# EAGLE design Battery Voltage Monitoring Schematic (EAGLE 8.2.2)
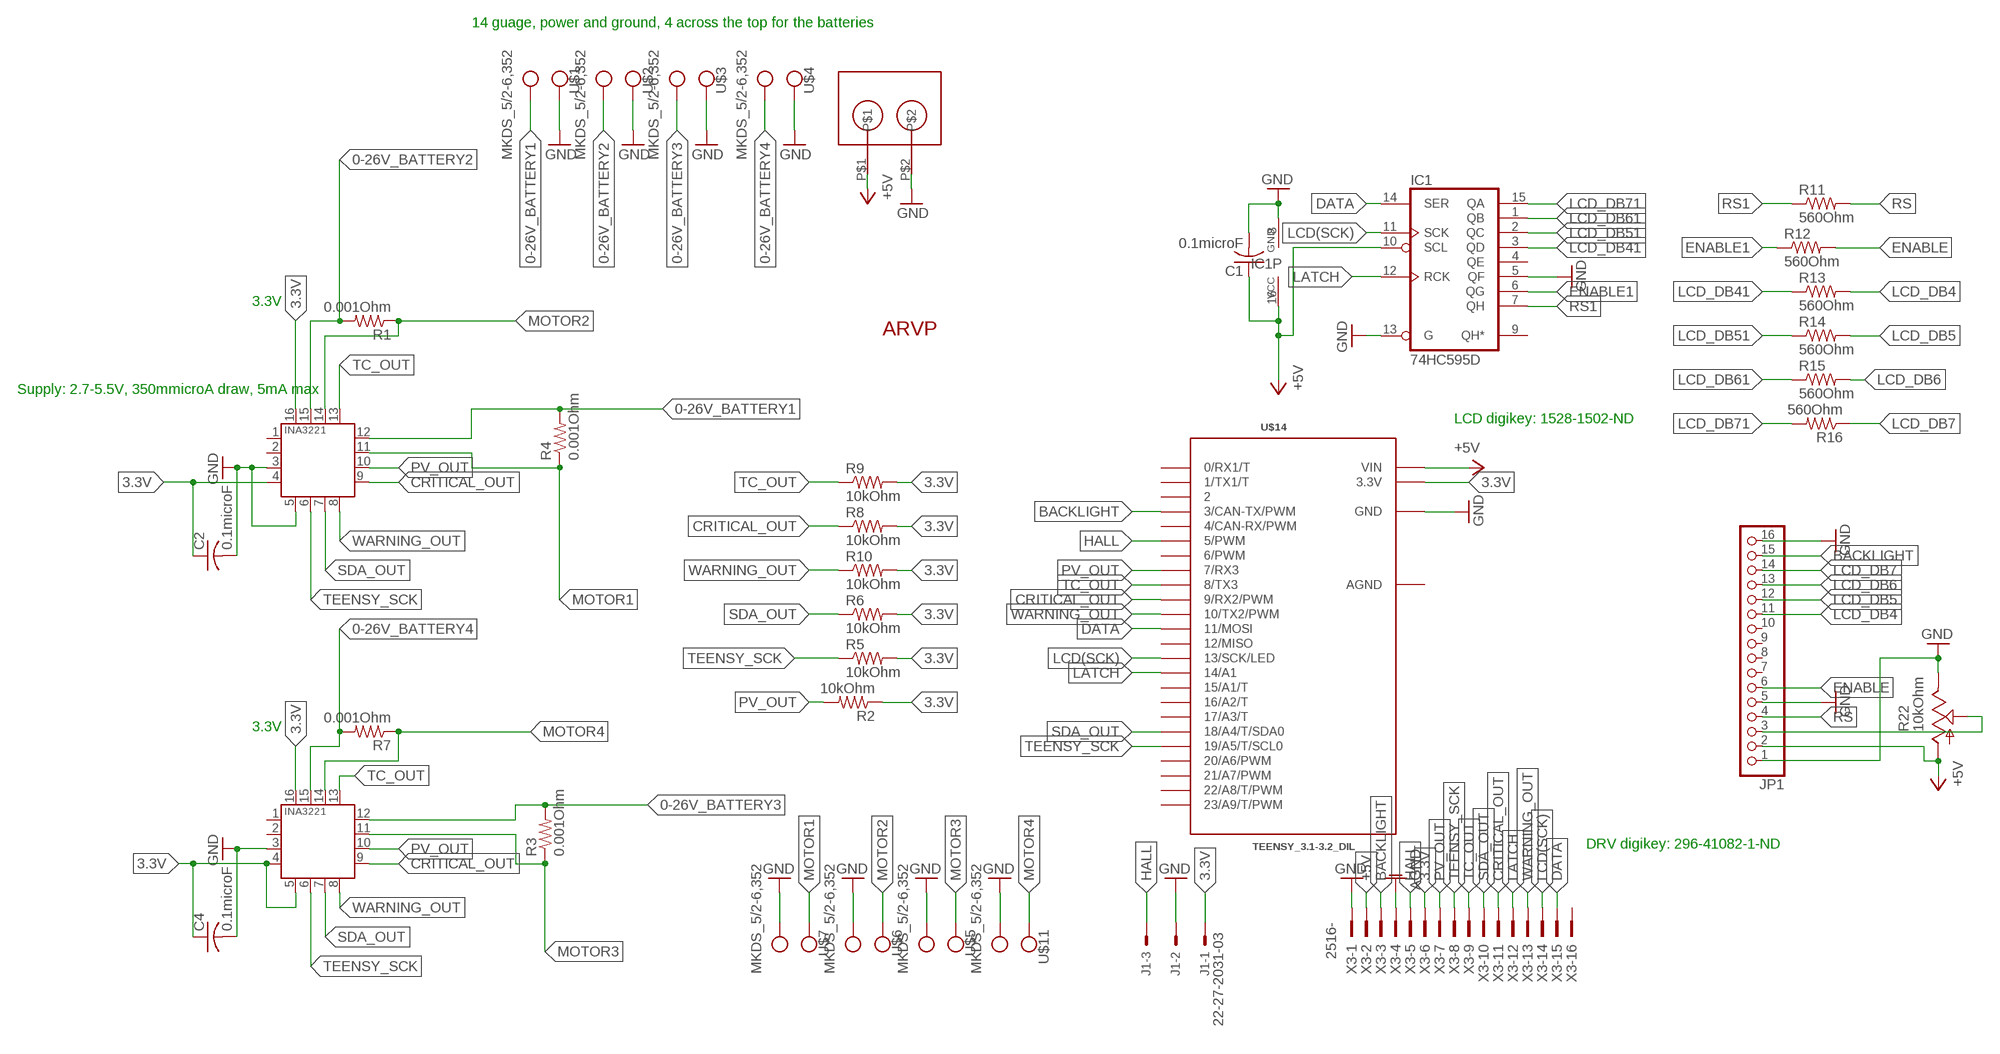
[diagram p0: schematic, sheet 1]

## Parts
C1  0.1microF  C-USC2012  [C2012]
C2  0.1microF  C-USC2012  [C2012]
C4  0.1microF  C-USC2012  [C2012]
IC1  74HC595D  [SO16]
J1  22-27-2031-03  [6410-03]
JP1  PINHD-1X16  [1X16]
R1  0.001Ohm  HCS3920FT1L00  [3920]
R2  10kOhm  R-US_M2012  [M2012]
R3  0.001Ohm  HCS3920FT1L00  [3920]
R4  0.001Ohm  HCS3920FT1L00  [3920]
R5  10kOhm  R-US_M2012  [M2012]
R6  10kOhm  R-US_M2012  [M2012]
R7  0.001Ohm  HCS3920FT1L00  [3920]
R8  10kOhm  R-US_M2012  [M2012]
R9  10kOhm  R-US_M2012  [M2012]
R10  10kOhm  R-US_M2012  [M2012]
R11  560Ohm  R-US_M2012  [M2012]
R12  560Ohm  R-US_M2012  [M2012]
R13  560Ohm  R-US_M2012  [M2012]
R14  560Ohm  R-US_M2012  [M2012]
R15  560Ohm  R-US_M2012  [M2012]
R16  560Ohm  R-US_M2012  [M2012]
R22  10kOhm  TRIM_US-SM-42/43W  [SM-42/43W]
U1  INA3221.  [HVQFN16_4X4]
U2  INA3221.  [HVQFN16_4X4]
U$1  MKDS_5/2-6,352  [MKDS_5/2-6,35]
U$2  MKDS_5/2-6,352  [MKDS_5/2-6,35]
U$3  MKDS_5/2-6,352  [MKDS_5/2-6,35]
U$4  MKDS_5/2-6,352  [MKDS_5/2-6,35]
U$5  MKDS_5/2-6,352  [MKDS_5/2-6,35]
U$6  MKDS_5/2-6,352  [MKDS_5/2-6,35]
U$7  MKDS_5/2-6,352  [MKDS_5/2-6,35]
U$9  ARVP_MOLEX_FEMALE  [ARVP_MOLEX_FEMALE]
U$10  ARVP_LOGO  [ARVP]
U$11  MKDS_5/2-6,352  [MKDS_5/2-6,35]
U$14  TEENSY_3.1-3.2_DIL  [TEENSY_3.0-3.2&LC_DIL]
X3  2516-  [PAK100/2500-16]

## Nets
0-26V_BATTERY1: R4.P$2 U1.12(IN+1) U$1.1(KL)
0-26V_BATTERY2: R1.P$2 U1.15(IN+2) U$2.1(KL)
0-26V_BATTERY3: R3.P$2 U2.12(IN+1) U$3.1(KL)
0-26V_BATTERY4: R7.P$2 U2.15(IN+2) U$4.1(KL)
3.3V: C2.1 C4.1 J1.1 R2.1 R5.2 R6.2 R8.2 R9.2 R10.2 U1.4(VS) U1.16(VPU) U2.4(VS) U2.5(A0) U2.16(VPU) U$14.3.3V X3.6
+5V: C1.1 IC1.10(SCL) IC1.16(VCC) JP1.2 R22.1(A) U$9.P$1 U$14.VIN X3.2
AGND: X3.4
BACKLIGHT: JP1.15 U$14.3(3/CAN-TX/PWM) X3.3
CRITICAL_OUT: R8.1 U1.9(CRITICAL) U2.9(CRITICAL) U$14.9(9/RX2/PWM) X3.11
DATA: IC1.14(SER) U$14.11(11/MOSI) X3.15
ENABLE: JP1.6 R12.2
ENABLE1: IC1.6(QG) R12.1
GND: C1.2 C2.2 C4.2 IC1.5(QF) IC1.8(GND) IC1.13(G) J1.2 JP1.1 JP1.5 JP1.16 R22.3(E) U1.3(GND) U1.5(A0) U2.3(GND) U$1.2(KL1) U$2.2(KL1) U$3.2(KL1) U$4.2(KL1) U$5.1(KL) U$6.1(KL) U$7.1(KL) U$9.P$2 U$11.1(KL) U$14.GND X3.1
HALL: J1.3 U$14.5(5/PWM) X3.5
LATCH: IC1.12(RCK) U$14.14/A0(14/A1) X3.12
LCD(SCK): IC1.11(SCK) U$14.13(13/SCK/LED) X3.14
LCD_DB4: JP1.11 R13.2
LCD_DB5: JP1.12 R14.2
LCD_DB6: JP1.13 R15.2
LCD_DB7: JP1.14 R16.1
LCD_DB41: IC1.3(QD) R13.1
LCD_DB51: IC1.2(QC) R14.1
LCD_DB61: IC1.1(QB) R15.1
LCD_DB71: IC1.15(QA) R16.2
MOTOR1: R4.P$1 U1.11(IN-1) U$7.2(KL1)
MOTOR2: R1.P$1 U1.14(IN-2) U$6.2(KL1)
MOTOR3: R3.P$1 U2.11(IN-1) U$5.2(KL1)
MOTOR4: R7.P$1 U2.14(IN-2) U$11.2(KL1)
N$18: JP1.3 R22.2(S)
PV_OUT: R2.2 U1.10(PV) U2.10(PV) U$14.7(7/RX3) X3.7
RS: JP1.4 R11.2
RS1: IC1.7(QH) R11.1
SDA_OUT: R6.1 U1.7(SDA) U2.7(SDA) U$14.18/A4(18/A4/T/SDA0) X3.10
TC_OUT: R9.1 U1.13(TC) U2.13(TC) U$14.8(8/TX3) X3.9
TEENSY_SCK: R5.1 U1.6(SCL) U2.6(SCL) U$14.19/A5(19/A5/T/SCL0) X3.8
WARNING_OUT: R10.1 U1.8(WARNING) U2.8(WARNING) U$14.10(10/TX2/PWM) X3.13
Unconnected: IC1.4(QE) IC1.9(QH*) JP1.7 JP1.8 JP1.9 JP1.10 U1.1(IN-3) U1.2(IN+3) U2.1(IN-3) U2.2(IN+3) U$14.0(0/RX1/T) U$14.1(1/TX1/T) U$14.2 U$14.4(4/CAN-RX/PWM) U$14.6(6/PWM) U$14.12(12/MISO) U$14.15/A1(15/A1/T) U$14.16/A2(16/A2/T) U$14.17/A3(17/A3/T) U$14.20/A6(20/A6/PWM) U$14.21/A7(21/A7/PWM) U$14.22/A8(22/A8/T/PWM) U$14.23/A9(23/A9/T/PWM) X3.16

## Notes on the sheet
- 14 guage, power and ground, 4 across the top for the batteries
- 3.3V
- Supply: 2.7-5.5V, 350mmicroA draw, 5mA max
- LCD digikey: 1528-1502-ND
- 3.3V
- DRV digikey: 296-41082-1-ND

## Power pins joined to a net without a drawn wire
AGND: U$14.AGND

## Library data of the parts
C1 C2 C4 = resistor:C-US: CAPACITOR, American symbol
IC1 = 74xx-eu:74*595: 8-bit SHIFT REGISTER, output latch
J1 = con-molex:22-?-03: CONNECTOR wire to board 2.54 mm (.1 inch) pitch header; OC_FARNELL: unknown; OC_NEWARK: unknown
JP1 = pinhead:PINHD-1X16: PIN HEADER
R1 R3 R4 R7 = Moira:HCS3920: 0.001 Ohm ±1% 5W Chip Resistor 4020 Automotive AEC-Q200, Current Sense, Moisture Resistant Metal Element Stackpole Electronics Inc. Digikey: HCS3920FT1L00CT-ND
R2 R5 R6 R8-R16 = rcl:R-US_: RESISTOR, American symbol
R22 = pot:TRIM_US-: POTENTIOMETER
U1 U2 = INA3221:INA3221: The INA3221 is a three-channel, high-side current and bus voltage monitor with an I 2C- and SMBUScompatible interface. The INA3221 monitors both shunt voltage drops and bus supply voltages, in addition to having programmable conversion times and averaging modes for these signals. The INA3221 offers both critical and warning alerts to detect multiple programmable out-of-range conditions for each channel.
U$1-U$7 U$11 = Moira:MKDS_5/2-6,35: CONN TERM BLOCK 2POS 6.35MM PCB, 2 Position Wire to Board Terminal Block Horizontal with Board 0.250" (6.35mm) Through Hole, Phoenix Contact (1714955), Digikey:277-1269-ND, MKDS 5/2-6,35 package adpated from Eagle library package MKDS 5/3-6,35
U$9 = ARVP_MOLEX_FEMALE:ARVP_MOLEX_FEMALE
U$10 = ARVP:ARVP_LOGO
U$14 = Teensy_3_and_LC_Series_Boards_v1.4:TEENSY_3.1-3.2_DIL: Teensy 3.1 or 3.2 in a DIL Layout.
X3 = con-3m:2516-: 3M (TM) Pak 100 4-Wall Header Source: 3M; OC_FARNELL: unknown; OC_NEWARK: unknown

## Board
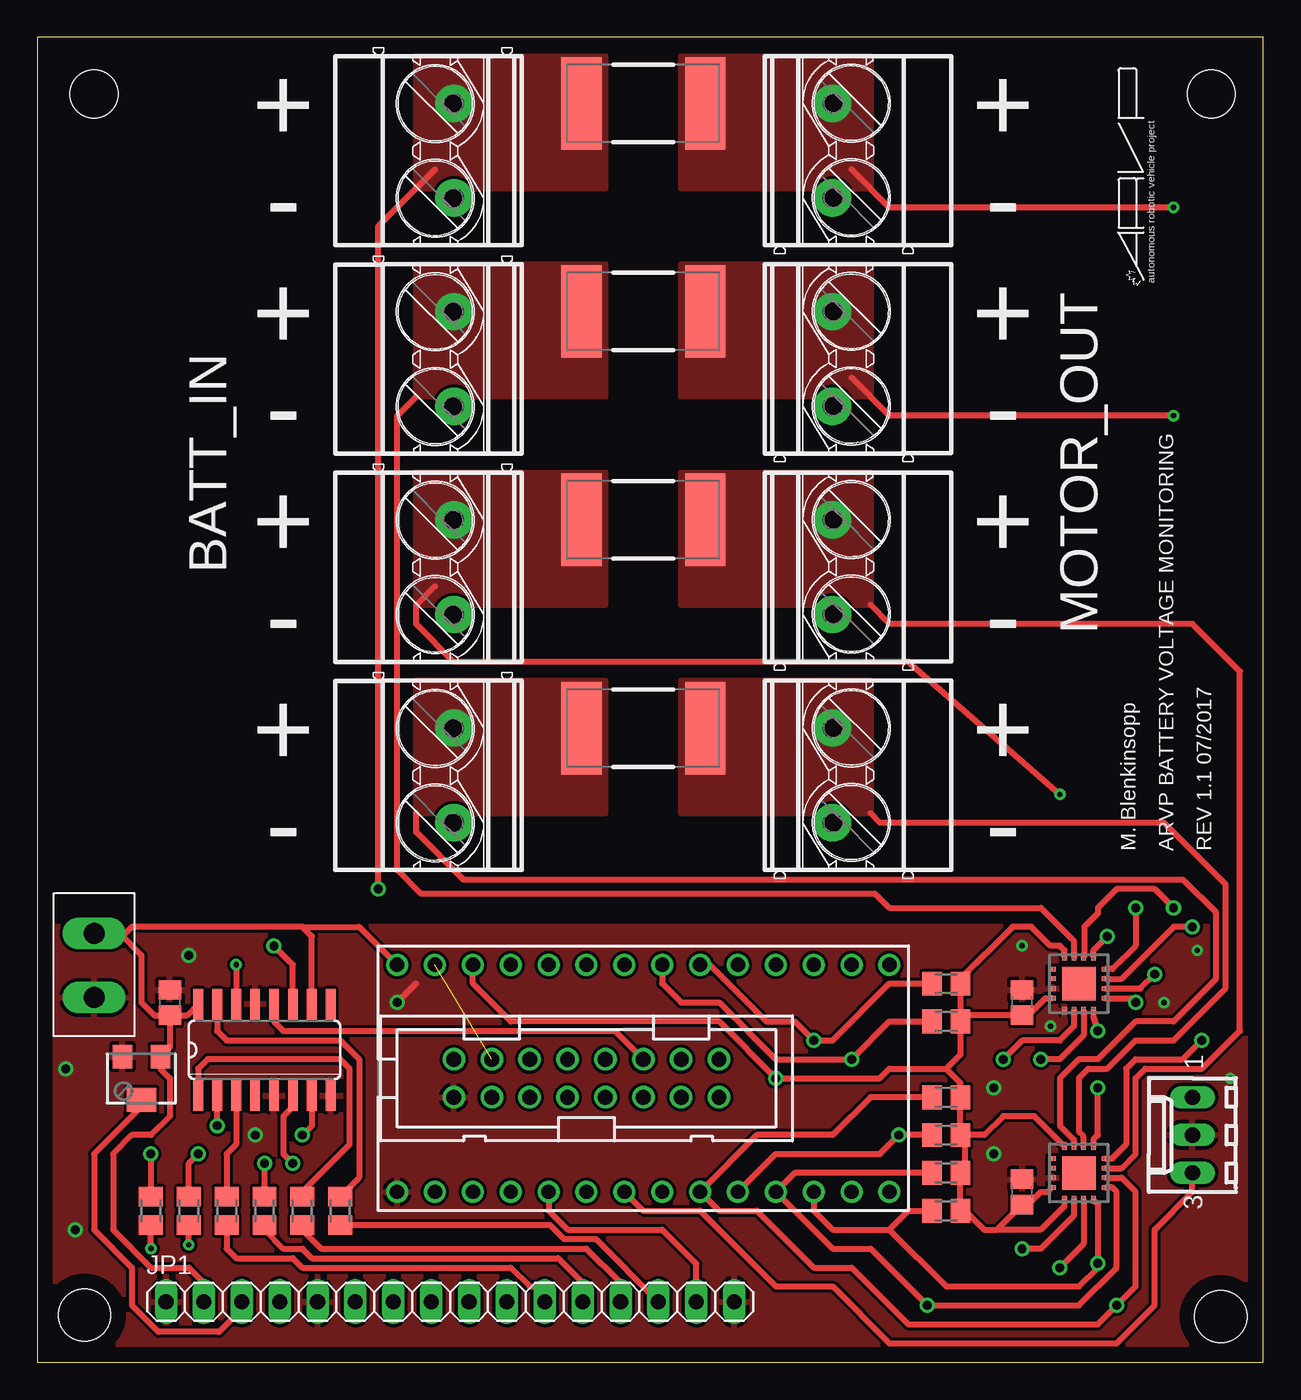
[diagram p1: board, top side]
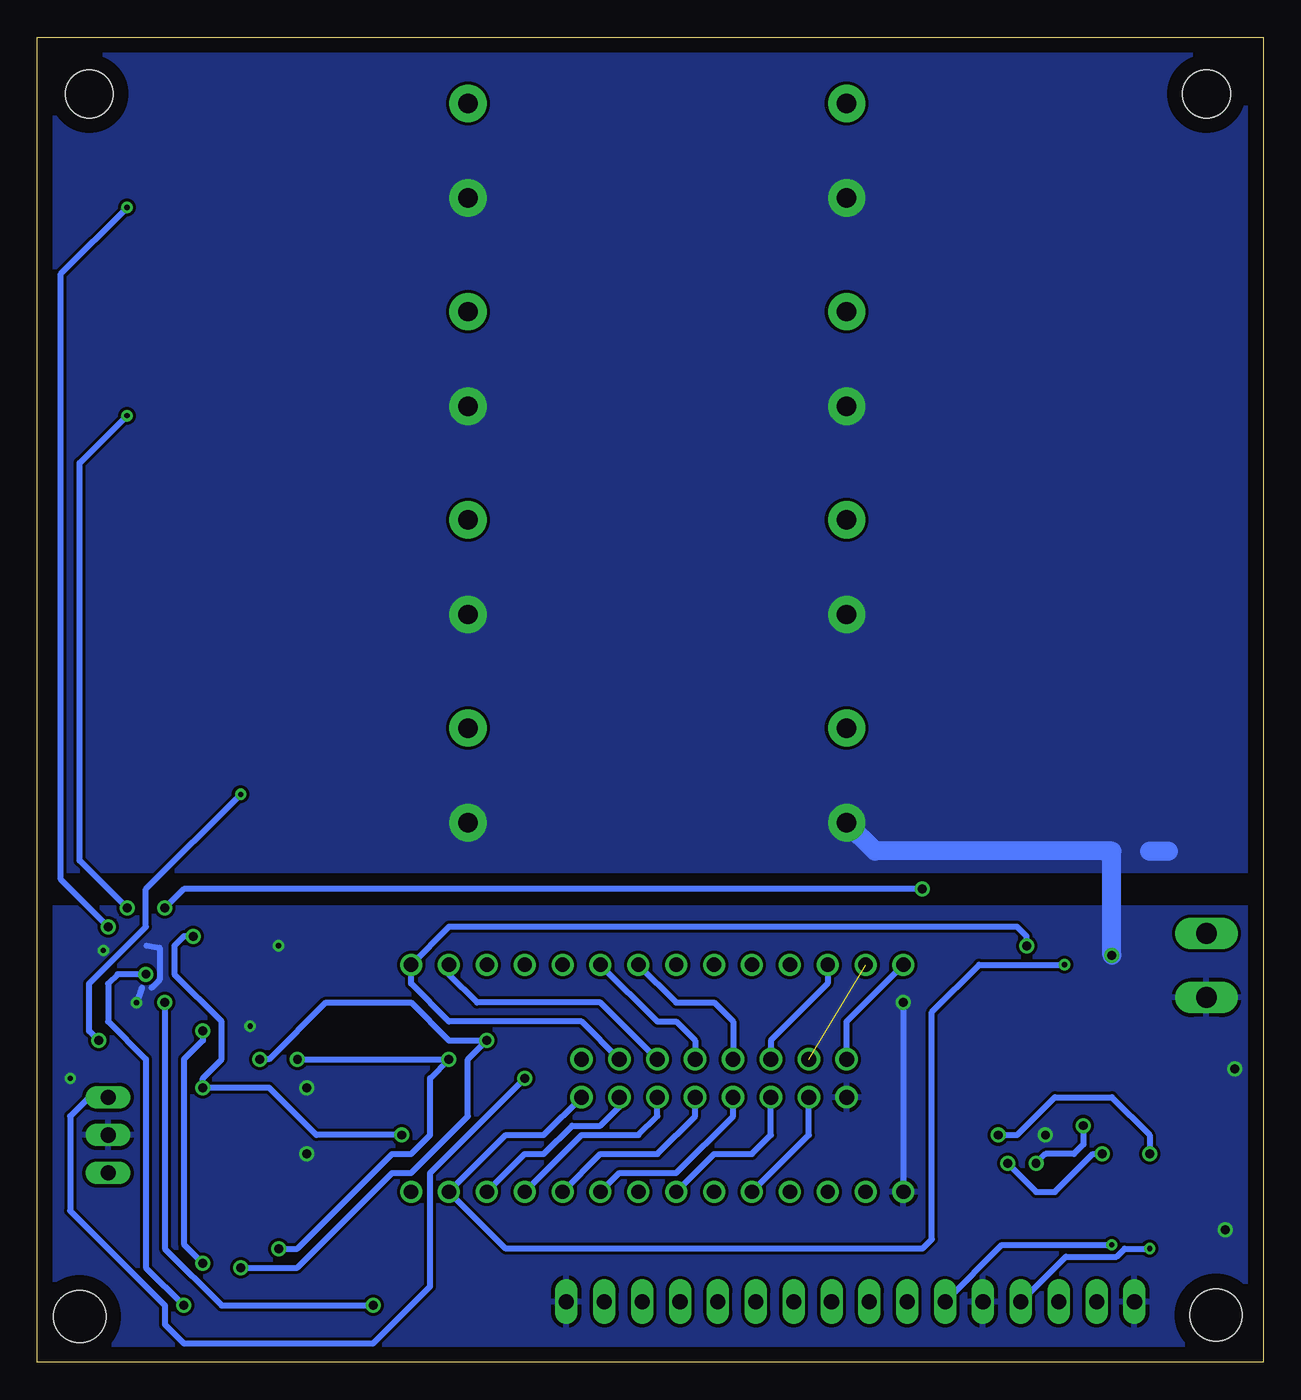
[diagram p2: board, bottom side, seen from below]

Size 82.22 x 88.89 mm. Coordinates in mm from the lower left corner, seen from the top.
Outline: 0,0 82.22,0 82.22,88.89 0,88.89 0,0
Copper layers (1*16): Top 0.035mm / dielectric 1.5mm / Bottom 0.035mm
Design rules "default": minimum track width 10mil, minimum drill 24mil, track to track 8mil, track to pad 8mil, pad to pad 8mil, via to via 8mil, smd to smd 8mil, copper to edge 40mil, drill to drill 8mil, minimum pad ring 10mil, minimum via ring 8mil, stop-mask expansion 4mil, vias tented up to drill 0mil, thermal gap 10mil
Holes 3.51 mm at 3.17,3.17 79.38,3.07
Holes 3.2 mm at 78.74,85.09 3.81,85.09

### Footprints (pad centres in the part's own frame; a part is rotated, then mirrored left to right if it is on the bottom)
C2012 = smd 1.3 x 1.5: 1 -0.85,0; 2 0.85,0
SO16 = smd 0.66 x 2.032: 1 -4.445,-3.073; 2 -3.175,-3.073; 3 -1.905,-3.073; 4 -0.635,-3.073; 5 0.635,-3.073; 6 1.905,-3.073; 7 3.175,-3.073; 8 4.445,-3.073; 9 4.445,3.073; 10 3.175,3.073; 11 1.905,3.073; 12 0.635,3.073; 13 -0.635,3.073; 14 -1.905,3.073; 15 -3.175,3.073; 16 -4.445,3.073
6410-03 = drill 1.016 long: 1 2.54,0; 2 0,0; 3 -2.54,0
1X16 = drill 1.016 long: 1 -19.05,0; 2 -16.51,0; 3 -13.97,0; 4 -11.43,0; 5 -8.89,0; 6 -6.35,0; 7 -3.81,0; 8 -1.27,0; 9 1.27,0; 10 3.81,0; 11 6.35,0; 12 8.89,0; 13 11.43,0; 14 13.97,0; 15 16.51,0; 16 19.05,0
3920 = smd 2.7 x 6.2: P$1 -4.15,0; P$2 4.15,0
M2012 = smd 1.3 x 1.6: 1 -0.95,0; 2 0.95,0
SM-42/43W = smd 1.3 x 1.6: 1 -1.27,-1.45; 3 1.27,-1.45 | smd 2 x 1.6: 2 0,1.45
HVQFN16_4X4 = smd 0.5 x 0.3: 1 -1.8,0.975; 2 -1.8,0.325; 3 -1.8,-0.325; 4 -1.8,-0.975; 9 1.8,-0.975; 10 1.8,-0.325; 11 1.8,0.325; 12 1.8,0.975 | smd 0.3 x 0.5: 5 -0.975,-1.8; 6 -0.325,-1.8; 7 0.325,-1.8; 8 0.975,-1.8; 13 0.975,1.8; 14 0.325,1.8; 15 -0.325,1.8; 16 -0.975,1.8 | smd 2.25 x 2.25: TH 0,0
MKDS_5/2-6,35 = drill 1.3 pad 2.5: 1 -3.175,0; 2 3.175,0
ARVP_MOLEX_FEMALE = drill 1.4 long: P$1 -2.1,0; P$2 2.2,0
TEENSY_3.0-3.2&LC_DIL = drill 0.965: 0 -7.62,13.97; 1 -7.62,11.43; 2 -7.62,8.89; 3 -7.62,6.35; 3.3V 7.62,11.43; 4 -7.62,3.81; 5 -7.62,1.27; 6 -7.62,-1.27; 7 -7.62,-3.81; 8 -7.62,-6.35; 9 -7.62,-8.89; 10 -7.62,-11.43; 11 -7.62,-13.97; 12 -7.62,-16.51; 13 7.62,-16.51; 14/A0 7.62,-13.97; 15/A1 7.62,-11.43; 16/A2 7.62,-8.89; 17/A3 7.62,-6.35; 18/A4 7.62,-3.81; 19/A5 7.62,-1.27; 20/A6 7.62,1.27; 21/A7 7.62,3.81; 22/A8 7.62,6.35; 23/A9 7.62,8.89; AGND 7.62,13.97; GND -7.62,16.51; VIN 7.62,16.51
PAK100/2500-16 = drill 1 pad 1.422: 1 -8.89,-1.27; 2 -8.89,1.27; 3 -6.35,-1.27; 4 -6.35,1.27; 5 -3.81,-1.27; 6 -3.81,1.27; 7 -1.27,-1.27; 8 -1.27,1.27; 9 1.27,-1.27; 10 1.27,1.27; 11 3.81,-1.27; 12 3.81,1.27; 13 6.35,-1.27; 14 6.35,1.27; 15 8.89,-1.27; 16 8.89,1.27

### Placement (x,y rotation side)
C1  8.89,24.13 90 top
C2  66.04,24.13 90 top
C4  66.04,11.43 90 top
IC1  15.24,20.95 0 top
J1  77.47,15.24 90 top
JP1  27.69,4.06 0 top
R1  40.64,70.48 180 top
R2  60.96,17.78 180 top
R3  40.64,56.52 180 top
R4  40.64,84.45 180 top
R5  60.96,22.86 0 top
R6  60.96,25.4 0 top
R7  40.64,42.55 180 top
R8  60.96,12.7 0 top
R9  60.96,15.24 0 top
R10  60.96,10.16 0 top
R11  7.62,10.16 270 top
R12  10.16,10.16 270 top
R13  12.7,10.16 270 top
R14  15.24,10.16 270 top
R15  17.78,10.16 270 top
R16  20.32,10.16 90 top
R22  6.98,19.05 180 top
U1  69.85,25.4 0 top
U2  69.85,12.7 0 top
U$1  27.94,81.28 270 top
U$2  27.94,67.31 270 top
U$3  27.94,53.34 270 top
U$4  27.94,39.37 270 top
U$5  53.34,53.34 90 top
U$6  53.34,67.31 90 top
U$7  53.34,81.28 90 top
U$9  3.81,26.67 270 top
U$10  74.93,72.39 90 top
U$11  53.34,39.37 90 top
U$14  40.64,19.05 90 top
X3  36.83,19.05 0 top

### Tracks (layer width: path | path; a pad name or v marks a point on that pad's centre or on a via)
0-26V_BATTERY1  (via drill 0.6)
  Top 0.406: v73.66,30.48 73.66,27.94 72.09,26.38 U1.12 | v22.86,31.75 22.86,76.2 26.67,80.01
  Bottom 0.406: v22.86,31.75 72.39,31.75 v73.66,30.48
  pour Top (no thermals): 38.1,87.63 38.1,78.74 25.4,78.74 25.4,87.63
0-26V_BATTERY2
  Top 0.406: U1.15 69.53,28.26 67.31,30.48 57.15,30.48 56.2,31.43 25.72,31.43 24.13,33.02 24.13,63.5 25.4,64.77 | 27.3,70.48 U$2.1
  pour Top (no thermals): 38.1,73.66 38.1,64.77 25.4,64.77 25.4,73.66
0-26V_BATTERY3  (via drill 0.35, 0.6)
  Top 0.406: U2.12 72.09,13.68 73.03,14.61 73.03,19.68 73.66,20.32 76.84,20.32 v78.11,21.59 | v68.58,38.1 58.42,46.99 27.94,46.99 25.4,49.53 25.4,50.8 26.67,52.07
  Bottom 0.406: v78.11,21.59 78.74,22.22 78.74,25.4 74.93,29.21 74.93,31.75 v68.58,38.1
  pour Top (no thermals): 38.1,59.69 38.1,50.8 25.4,50.8 25.4,59.69
0-26V_BATTERY4
  Top 0.406: U2.15 69.53,14.93 68.58,15.88 68.58,19.05 69.85,20.32 71.12,20.32 73.66,22.86 76.2,22.86 79.06,25.72 79.06,30.16 76.84,32.38 28.57,32.38 25.4,35.56 25.4,36.83
  pour Top (no thermals): 38.1,45.72 38.1,36.83 25.4,36.83 25.4,45.72
3.3V  (via drill 0.6)
  Top 0.406: U2.4 67.75,11.43 67.31,11.43 66.46,10.58 C4.1 64.35,8.89 | U1.4 67.61,24.42 66.46,23.28 C2.1 62.33,23.28 R5.2 | R9.2 62.23,14.92 62.23,12.7 R8.2 R10.2 62.23,10.16 63.5,8.89 64.35,8.89 | R9.2 R2.1 61.91,18.73 60.96,19.68 | U2.5 68.88,10.46 67.31,8.89 64.35,8.89 | U$14.3.3V 29.21,25.4 31.75,22.86 45.72,22.86 v49.53,19.05 56.52,19.05 57.15,19.68 60.96,19.68 | R5.2 R6.2 61.91,25.71 65.41,29.21 66.67,29.21 67.95,27.94 68.58,27.94 68.88,27.64 U1.16 | R5.2 61.91,20.63 60.96,19.68 | U2.16 66.86,16.51 64.77,16.51 63.5,15.24 R9.2
  Bottom 0.406: U$14.3.3V 29.21,25.4 33.02,21.59 X3.6 | J1.1 78.74,17.78 80.01,16.51 80.01,10.16 73.66,3.81 73.66,2.54 72.39,1.27 59.69,1.27 55.88,5.08 55.88,12.7 v49.53,19.05
+5V
  Top 0.406: 17.78,29.21 21.59,29.21 U$14.VIN | C1.1 8.89,21.13 R22.1 8.26,19.68 8.89,19.05 8.89,16.51 7.62,15.24 6.35,15.24 5.08,13.97 5.08,8.89 7.62,6.35 10.16,6.35 11.18,5.33 JP1.2 | C1.1 10.05,23.28 IC1.16 | IC1.10 18.41,28.57 17.78,29.21 | 5.52,28.77 6.98,27.3 6.98,24.13 7.84,23.28 C1.1 | 5.52,28.77 U$9.P$1 | 17.78,29.21 6.35,29.21 5.91,28.77 5.52,28.77
  Bottom 0.406: X3.2 27.94,22.86 U$14.VIN
AGND  (1 unrouted)
BACKLIGHT
  Top 0.406: U$14.3 34.29,10.16 35.56,8.89 41.91,8.89 44.2,6.6 JP1.15
  Bottom 0.406: U$14.3 30.48,15.24 X3.3
CRITICAL_OUT  (via drill 0.6)
  Top 0.406: U2.9 72.09,11.72 72.39,11.43 72.39,6.35 69.85,3.81 v59.69,3.81 55.88,7.62 53.34,7.62 U$14.9 50.8,12.7 R8.1 | U1.9 73.37,24.42 v73.66,24.13
  Bottom 0.406: U$14.9 45.72,15.24 41.91,15.24 40.64,16.51 X3.11 | v73.66,24.13 73.66,7.62 69.85,3.81 v59.69,3.81
DATA  (via drill 0.35)
  Top 0.406: v13.34,26.67 IC1.14
  Bottom 0.406: X3.15 48.26,15.24 50.8,15.24 U$14.11 50.8,7.62 22.86,7.62 22.22,8.26 22.22,23.49 19.05,26.67 v13.34,26.67
ENABLE  (via drill 0.35)
  Top 0.406: v10.16,7.87 R12.2
  Bottom 0.406: JP1.6 17.53,7.87 v10.16,7.87
ENABLE1  (via drill 0.6)
  Top 0.406: IC1.6 17.14,17.14 16.51,16.51 16.51,13.97 v17.14,13.34 | R12.1 10.16,13.34 v10.79,13.97
  Bottom 0.406: v17.14,13.34 15.24,11.43 13.97,11.43 11.43,13.97 v10.79,13.97
GND  (via drill 0.35, 0.6)
  Top 0.406: 66.14,12.38 C4.2 | 66.14,25.07 C2.2 | 25.4,25.4 v24.13,24.13
  Bottom 0.406: v24.13,24.13 U$14.GND | 74.55,25.12 74.02,25.66 74.02,27.81 74.88,27.96 | 75.2,25.12 v75.56,24.13
  Bottom 1.27: U$4.2 26.04,34.29 10.16,34.29 v10.16,27.3 | 7.62,34.29 6.35,34.29
  other vias: 1.91,19.68 2.54,8.89 14.61,15.24 64.14,18.41 64.14,13.97 80.01,19.05 77.79,27.62 67.95,22.54 66.04,27.94
  pour Top: 0,29.21 0,0 82.55,0 82.55,29.21
  pour Bottom: 0,0 82.55,0 82.55,30.48 0,30.48
  pour Bottom (no thermals): -1.27,90.17 82.55,90.17 82.55,33.02 -1.27,33.02
HALL
  Top 0.406: U$14.5 40.64,10.16 44.45,10.16 49.53,5.08 53.34,5.08 57.15,1.27 72.39,1.27 74.93,3.81 74.93,8.89 77.47,11.43 J1.3
  Bottom 0.406: U$14.5 36.83,13.97 34.29,13.97 33.02,15.24 X3.5
LATCH
  Top 0.406: IC1.12 15.88,22.86 16.51,22.22 38.73,22.22 X3.12
  Bottom 0.406: X3.12 44.45,24.13 52.72,24.13 54.61,26.02 U$14.14/A0
LCD(SCK)  (via drill 0.6)
  Top 0.406: IC1.11 17.14,26.67 v15.88,27.94
  Bottom 0.406: X3.14 45.72,22.86 54.61,22.86 57.15,25.4 U$14.13 54.61,29.21 16.51,29.21 15.88,28.57 v15.88,27.94
LCD_DB4
  Top 0.406: R13.2 12.7,7.62 13.34,6.98 17.14,6.98 17.78,6.35 31.75,6.35 33.02,5.08 33.66,5.08 34.04,4.7 JP1.11
LCD_DB5
  Top 0.406: R14.2 15.24,8.89 16.51,7.62 17.78,7.62 18.41,6.98 34.92,6.98 36.58,5.33 JP1.12
LCD_DB6
  Top 0.406: R15.2 17.78,8.89 19.05,7.62 36.83,7.62 39.06,5.39 | 39.06,5.39 39.12,5.33 | JP1.13 39.06,4.12 39.06,5.39
LCD_DB7
  Top 0.406: R16.1 34.38,9.21 35.31,8.28 37.44,8.28 JP1.14
LCD_DB41
  Top 0.406: IC1.3 13.34,14.61 12.7,13.97 R13.1
LCD_DB51  (via drill 0.6)
  Top 0.406: R14.1 v15.24,13.34 | v12.07,15.88 IC1.2
  Bottom 0.406: v12.07,15.88 12.07,14.61 12.7,13.97 14.61,13.97 v15.24,13.34
LCD_DB61
  Top 0.406: R15.1 17.78,11.43 20.95,14.61 20.95,19.68 20.32,20.32 11.43,20.32 10.79,19.68 IC1.1
LCD_DB71
  Top 0.406: IC1.15 12.07,22.22 12.7,21.59 20.32,21.59 21.59,20.32 21.59,12.38 R16.2
MOTOR1  (via drill 0.35, 0.6)
  Top 0.406: U1.11 72.72,25.72 76.2,29.21 v77.47,29.21 | v76.2,77.47 57.15,77.47 54.61,80.01
  Bottom 0.406: v77.47,29.21 80.64,32.38 80.64,73.03 v76.2,77.47
  pour Top (no thermals): 55.88,87.63 55.88,78.74 43.18,78.74 43.18,87.63
MOTOR2  (via drill 0.35, 0.6)
  Top 0.406: v76.2,30.48 74.93,31.75 72.39,31.75 71.12,30.48 71.12,30.11 70.22,29.21 70.22,27.24 U1.14 | v76.2,63.5 57.15,63.5 54.61,66.04
  Bottom 0.406: v76.2,30.48 79.38,33.66 79.38,60.33 v76.2,63.5
  pour Top (no thermals): 55.88,73.66 55.88,64.77 43.18,64.77 43.18,73.66
MOTOR3
  Top 0.406: U2.11 72.72,13.03 73.66,13.97 73.66,19.05 74.3,19.68 78.11,19.68 80.64,22.22 80.64,46.36 77.47,49.53 57.15,49.53 55.88,50.8
  pour Top (no thermals): 55.88,59.69 55.88,50.8 43.18,50.8 43.18,59.69
MOTOR4
  Top 0.406: 55.88,36.83 56.52,36.2 75.56,36.2 79.69,32.07 79.69,25.08 76.2,21.59 73.66,21.59 71.75,19.68 70.48,19.68 69.85,19.05 69.85,15.47 70.14,15.18 70.14,14.54 U2.14
  pour Top (no thermals): 55.88,45.72 55.88,36.83 43.18,36.83 43.18,45.72
N$18
  Top 0.406: R22.2 6.98,17.14 3.81,13.97 3.81,8.89 6.35,6.35 6.35,3.81 8.13,2.03 12.19,2.03 13.72,3.56 JP1.3
PV_OUT  (via drill 0.6)
  Top 0.406: U2.10 72.72,12.38 73.66,11.43 73.66,5.08 v72.39,3.81 71.12,2.54 58.42,2.54 54.61,6.35 52.07,6.35 48.26,10.16 45.72,10.16 U$14.7 48.26,15.24 53.34,15.24 55.88,17.78 R2.2 | U1.10 73.98,25.07 v74.93,26.04
  Bottom 0.406: X3.7 35.56,16.51 39.37,12.7 43.18,12.7 U$14.7 | v72.39,3.81 74.93,6.35 74.93,20.32 77.47,22.86 77.47,25.4 76.84,26.04 v74.93,26.04
RS  (via drill 0.35)
  Top 0.406: v7.62,7.62 R11.2
  Bottom 0.406: v7.62,7.62 9.3,7.62 9.84,7.09 13.23,7.09 JP1.4
RS1  (via drill 0.6)
  Top 0.406: IC1.7 18.41,15.88 v17.78,15.24 | v7.62,13.97 R11.1
  Bottom 0.406: v17.78,15.24 16.51,15.24 13.97,17.78 10.16,17.78 7.62,15.24 v7.62,13.97
SDA_OUT  (via drill 0.6)
  Top 0.406: U$14.18/A4 45.09,26.67 48.9,22.86 50.8,22.86 v52.07,21.59 53.34,21.59 57.15,25.4 R6.1 | U2.7 70.17,7.95 v68.58,6.35 | U1.7 70.17,21.91 68.58,20.32 v67.31,20.32
  Bottom 0.406: U$14.18/A4 40.64,22.86 39.37,22.86 38.1,21.59 X3.10 | v68.58,6.35 64.77,6.35 58.42,12.7 57.15,12.7 53.34,16.51 53.34,20.32 v52.07,21.59 54.61,21.59 57.15,24.13 62.87,24.13 66.67,20.32 v67.31,20.32
TC_OUT  (via drill 0.6)
  Top 0.406: R9.1 v57.79,15.24 56.52,13.97 49.53,13.97 U$14.8 | U2.13 70.83,14.95 71.12,15.24 v71.12,18.41 | U1.13 70.83,27.64 v71.75,28.57
  Bottom 0.406: U$14.8 44.45,13.97 40.64,13.97 38.1,16.51 X3.9 | v57.79,15.24 63.5,15.24 66.67,18.41 v71.12,18.41 71.12,19.05 69.85,20.32 69.85,22.86 73.03,26.04 73.03,27.94 72.39,28.57 v71.75,28.57
TEENSY_SCK  (via drill 0.6)
  Top 0.406: U$14.19/A5 41.91,25.4 43.18,24.13 45.72,24.13 49.53,20.32 v54.61,20.32 57.15,22.86 R5.1 | U2.6 69.53,9.84 67.31,7.62 v66.04,7.62 | U1.6 69.53,22.54 68.58,21.59 66.04,21.59 v64.77,20.32
  Bottom 0.406: U$14.19/A5 39.37,24.13 36.83,24.13 35.56,22.86 X3.8 | v66.04,7.62 64.77,7.62 58.42,13.97 57.15,13.97 55.88,15.24 55.88,19.05 v54.61,20.32 v64.77,20.32
WARNING_OUT  (via drill 0.6)
  Top 0.406: U$14.10 52.07,10.16 53.34,8.89 57.15,8.89 | 57.15,8.89 60.96,5.08 69.85,5.08 71.12,6.35 v71.12,6.64 71.12,10.61 U2.8 | 57.15,8.89 58.42,10.16 R10.1 | U1.8 70.83,23.15 v71.12,22.22
  Bottom 0.406: U$14.10 49.53,13.97 48.26,13.97 46.36,15.88 44.45,15.88 43.18,17.14 X3.13 | v71.12,6.64 72.39,7.92 72.39,20.32 71.12,21.59 v71.12,22.22

### Text on the board
tPlace: + | + | - | - | + | + | - | - | BATT_IN | MOTOR_OUT | + | + | - | - | + | + | - | - | M. Blenkinsopp | ARVP BATTERY VOLTAGE MONITORING | REV 1.1 07/2017